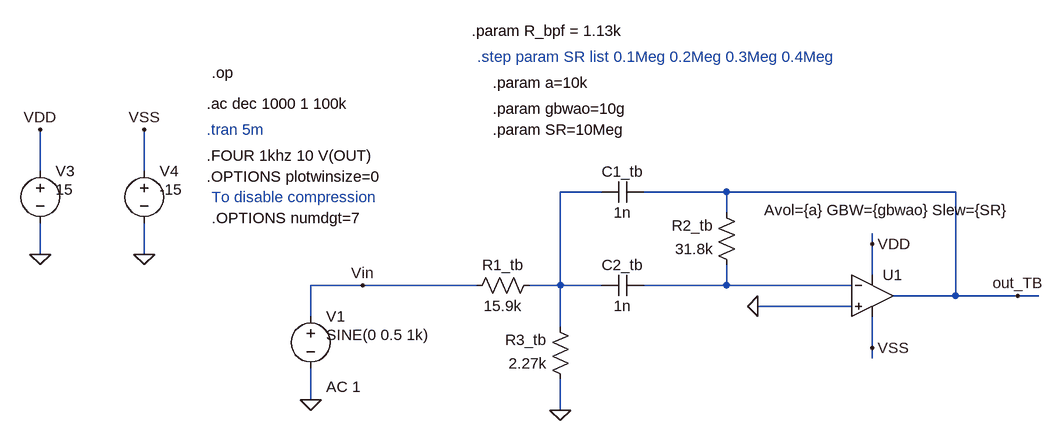
[diagram p0: schematic FTB_Deliyannis.asc]
FTB_Deliyannis.asc, the LTspice schematic file:
Version 4
SHEET 1 2932 1708
WIRE 1088 -16 1088 -80
WIRE 1248 -16 1248 -80
WIRE 1952 16 1888 16
WIRE 2144 16 2016 16
WIRE 2496 16 2144 16
WIRE 2144 48 2144 16
WIRE 2368 96 2368 80
WIRE 1088 112 1088 64
WIRE 1248 112 1248 64
WIRE 2368 144 2368 96
WIRE 1584 160 1504 160
WIRE 1760 160 1584 160
WIRE 1888 160 1888 16
WIRE 1888 160 1840 160
WIRE 1952 160 1888 160
WIRE 2144 160 2144 128
WIRE 2144 160 2016 160
WIRE 2336 160 2144 160
WIRE 2496 176 2496 16
WIRE 2496 176 2400 176
WIRE 2592 176 2496 176
WIRE 2624 176 2592 176
WIRE 2336 192 2192 192
WIRE 1504 208 1504 160
WIRE 1888 224 1888 160
WIRE 2368 256 2368 208
WIRE 2368 272 2368 256
WIRE 1504 336 1504 288
WIRE 1888 352 1888 304
FLAG 1088 112 0
FLAG 1248 112 0
FLAG 1088 -80 VDD
FLAG 1248 -80 VSS
FLAG 1504 336 0
FLAG 2592 176 out_TB
FLAG 2368 256 VSS
FLAG 2368 96 VDD
FLAG 1584 160 Vin
FLAG 2192 192 0
FLAG 1888 352 0
DATAFLAG 1664 160 ""
DATAFLAG 1920 160 ""
DATAFLAG 2192 160 ""
DATAFLAG 2272 192 ""
DATAFLAG 2464 176 ""
SYMBOL voltage 1088 -32 R0
WINDOW 123 24 124 Left 2
WINDOW 39 0 0 Left 2
WINDOW 3 24 44 Left 2
SYMATTR Value 15
SYMATTR InstName V3
SYMBOL voltage 1248 -32 R0
WINDOW 123 24 124 Left 2
WINDOW 39 0 0 Left 2
WINDOW 3 24 44 Left 2
SYMATTR Value -15
SYMATTR InstName V4
SYMBOL voltage 1504 192 R0
WINDOW 123 24 124 Left 2
WINDOW 39 0 0 Left 2
WINDOW 3 24 44 Left 2
SYMATTR Value2 AC 1
SYMATTR Value SINE(0 0.5 1k)
SYMATTR InstName V1
SYMBOL cap 2016 32 M270
WINDOW 0 32 32 VTop 2
WINDOW 3 0 32 VBottom 2
SYMATTR InstName C1_tb
SYMATTR Value 1n
SYMBOL res 1856 144 R90
WINDOW 0 0 56 VBottom 2
WINDOW 3 32 56 VTop 2
SYMATTR InstName R1_tb
SYMATTR Value 15.9k
SYMBOL res 2160 144 R180
WINDOW 0 36 76 Left 2
WINDOW 3 36 40 Left 2
SYMATTR InstName R2_tb
SYMATTR Value 31.8k
SYMBOL cap 1952 176 R270
WINDOW 0 32 32 VTop 2
WINDOW 3 0 32 VBottom 2
SYMATTR InstName C2_tb
SYMATTR Value 1n
SYMBOL Opamps\\UniversalOpamp2 2368 176 R0
WINDOW 123 -166 -132 Left 2
SYMATTR Value2 Avol={a} GBW={gbwao} Slew={SR}
SYMATTR InstName U1
SYMBOL res 1904 320 R180
WINDOW 0 36 76 Left 2
WINDOW 3 36 40 Left 2
SYMATTR InstName R3_tb
SYMATTR Value 2.27k
TEXT 1344 -120 Left 2 !.ac dec 1000 1 100k
TEXT 1352 -168 Left 2 !.op
TEXT 1344 -80 Left 2 ;.tran 5m
TEXT 1784 -152 Left 2 !.param a=10k
TEXT 1784 -112 Left 2 !.param gbwao=10g
TEXT 1784 -80 Left 2 !.param SR=10Meg
TEXT 1344 -40 Left 2 !.FOUR 1khz 10 V(OUT)
TEXT 1344 -8 Left 2 !.OPTIONS plotwinsize=0
TEXT 1352 24 Left 2 ;To disable compression
TEXT 1352 56 Left 2 !.OPTIONS numdgt=7
TEXT 1760 -192 Left 2 ;.step param SR list 0.1Meg 0.2Meg 0.3Meg 0.4Meg
TEXT 1752 -232 Left 2 !.param R_bpf = 1.13k

The netlist it stands for:
* FTB_Deliyannis.asc
V3 VDD 0 15
V4 VSS 0 -15
V1 Vin 0 SINE(0 0.5 1k) AC 1
C1_tb out_TB N001 1n
R1_tb N001 Vin 15.9k
R2_tb N002 out_TB 31.8k
C2_tb N001 N002 1n
XU1 0 N002 VDD VSS out_TB level.2 Avol={a} GBW={gbwao} Slew={SR} ilimit=25m rail=0 Vos=0 phimargin=45 en=0 enk=0 in=0 ink=0 Rin=500Meg  ; pins IN+ IN- V+ V- OUT
R3_tb 0 N001 2.27k
.ac dec 1000 1 100k
.op
* .tran 5m
.param a=10k
.param gbwao=10g
.param SR=10Meg
.FOUR 1khz 10 V(OUT)
.OPTIONS plotwinsize=0
* To disable compression
.OPTIONS numdgt=7
* .step param SR list 0.1Meg 0.2Meg 0.3Meg 0.4Meg
.param R_bpf = 1.13k
.lib UniversalOpamps2.sub
.backanno
.end